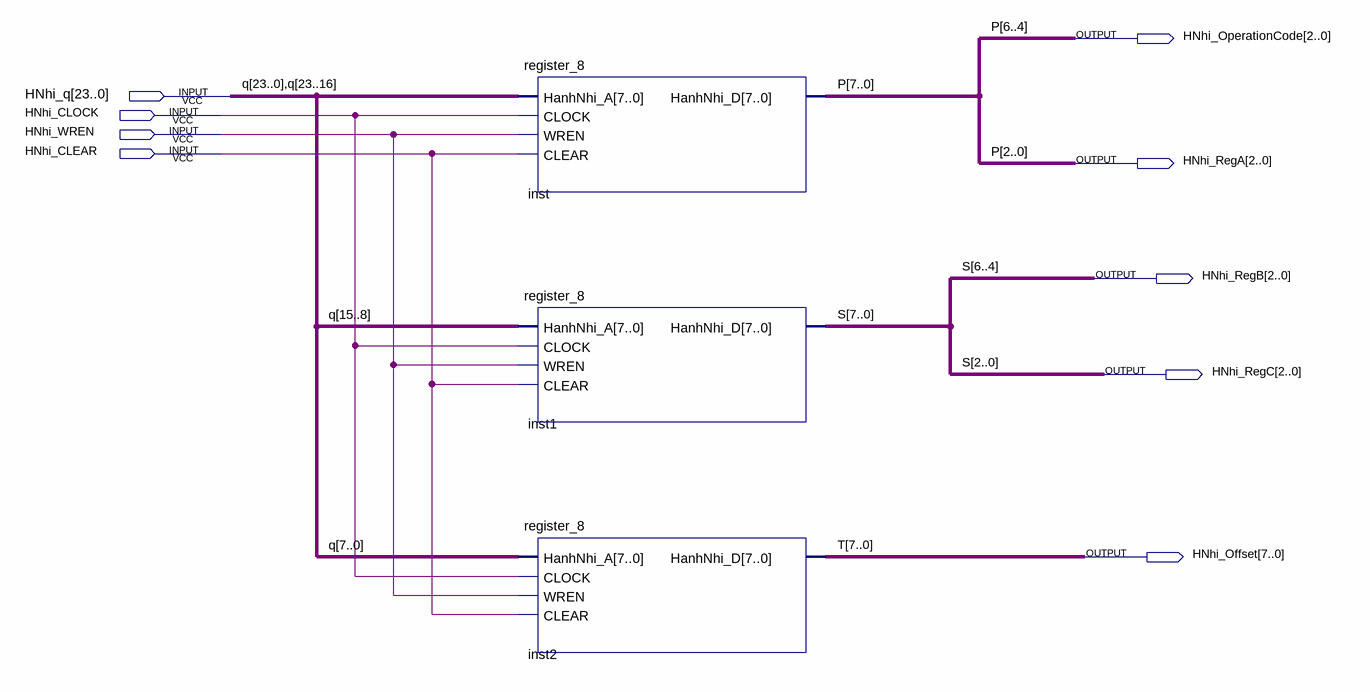
[diagram p0: schematic sheet]
// Quartus schematic Assignment4.bdf as structural Verilog: 3 symbols, 9 pins
module Assignment4 (
  input  [23:0] HNhi_q,
  input  HNhi_CLOCK,
  input  HNhi_WREN,
  input  HNhi_CLEAR,
  output [2:0] HNhi_OperationCode,
  output [2:0] HNhi_RegA,
  output [2:0] HNhi_RegB,
  output [2:0] HNhi_RegC,
  output [7:0] HNhi_Offset
);

  wire [7:3] P, S;
  wire [23:0] q;

  register_8 inst (
    .HanhNhi_A({q, q[23:16]}), .CLOCK(HNhi_CLOCK), .WREN(HNhi_WREN), .CLEAR(HNhi_CLEAR),
    .HanhNhi_D({P[7], HNhi_OperationCode, P[3], HNhi_RegA}));
  register_8 inst1 (
    .HanhNhi_A(q[15:8]), .CLOCK(HNhi_CLOCK), .WREN(HNhi_WREN), .CLEAR(HNhi_CLEAR),
    .HanhNhi_D({S[7], HNhi_RegB, S[3], HNhi_RegC}));
  register_8 inst2 (
    .HanhNhi_A(q[7:0]), .CLOCK(HNhi_CLOCK), .WREN(HNhi_WREN), .CLEAR(HNhi_CLEAR), .HanhNhi_D(HNhi_Offset));

  // Other names for the same wires on the sheet: P (some bits) = {HNhi_OperationCode, HNhi_RegA};
  //   S (some bits) = {HNhi_RegB, HNhi_RegC}; T[7:0] = HNhi_Offset
endmodule
